# EAGLE design BusPirate-v2a (EAGLE 5.03)
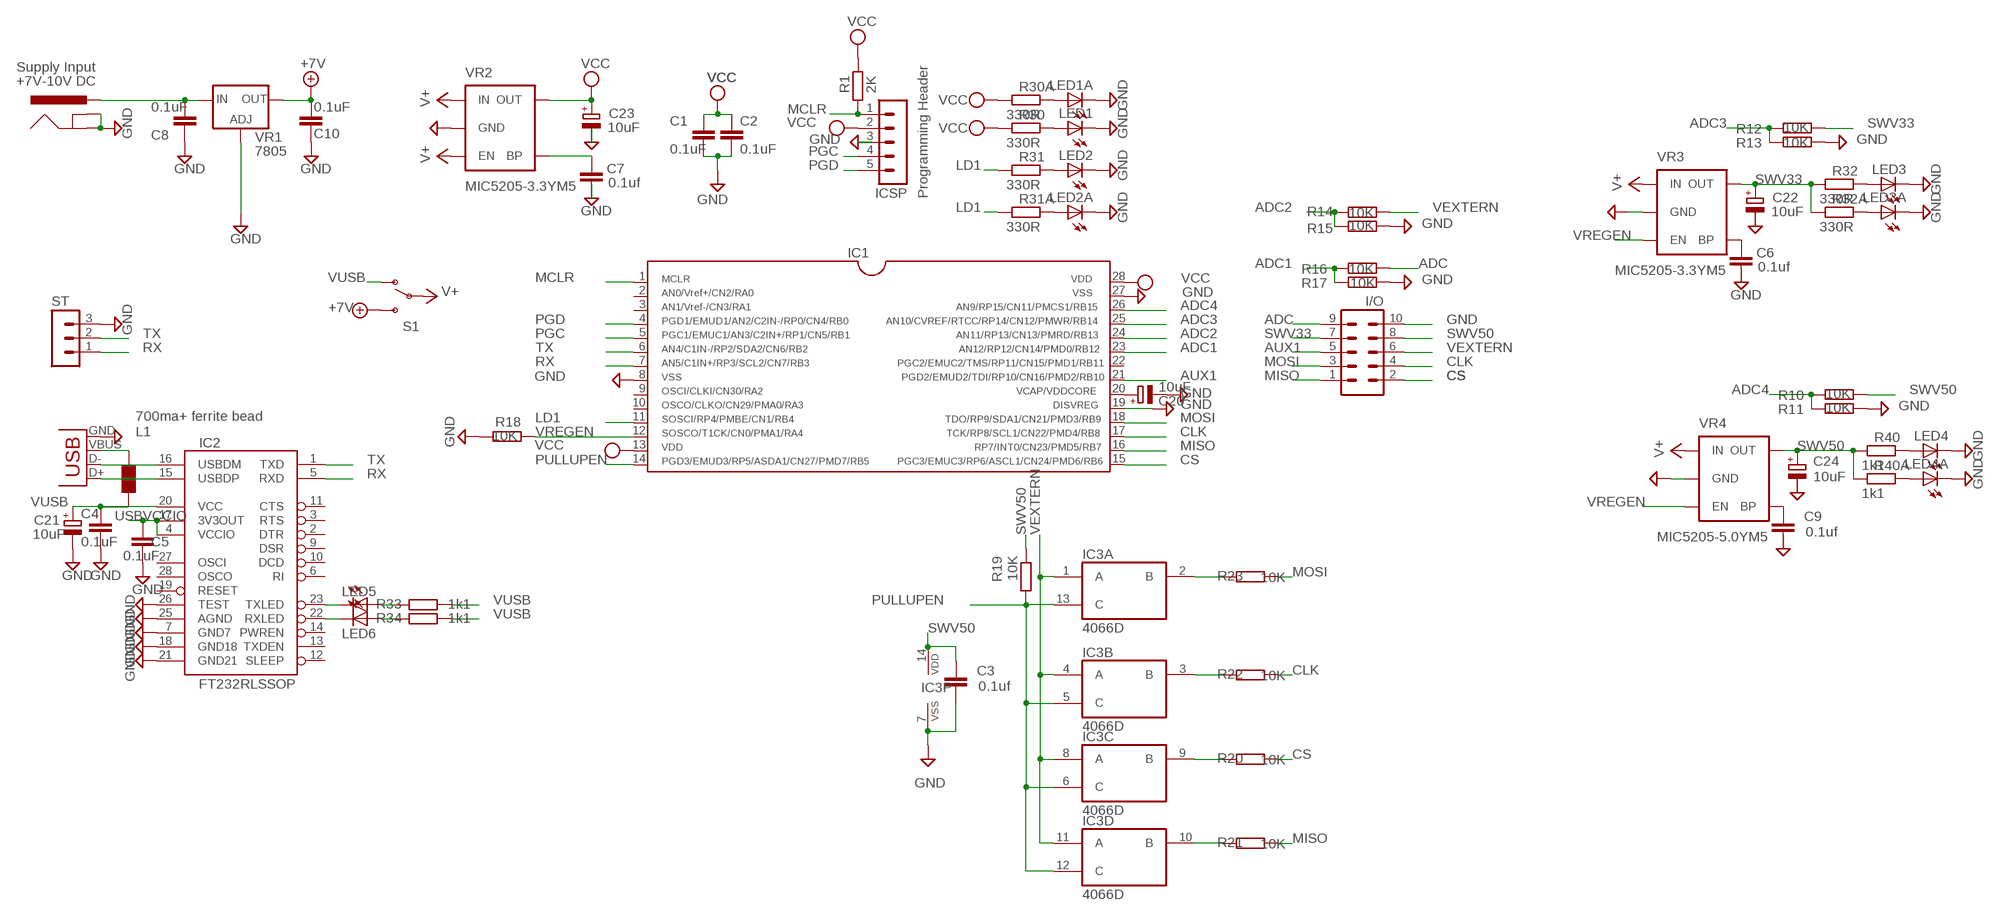
[diagram p0: schematic, sheet 1]

## Parts
C1  0.1uF  C-EUC0805  [C0805]
C2  0.1uF  C-EUC0805  [C0805]
C3  0.1uf  C-EUC0805  [C0805]
C4  0.1uF  C-EUC0805  [C0805]
C5  0.1uF  C-EUC0805  [C0805]
C6  0.1uf  C-EUC0805  [C0805]
C7  0.1uf  C-EUC0805  [C0805]
C8  0.1uF  C-EUC0805  [C0805]
C9  0.1uf  C-EUC0805  [C0805]
C10  0.1uF  C-EUC0805  [C0805]
C20  10uF  CPOL-EUSMCA  [SMC_A]
C21  10uF  CPOL-EUSMCA  [SMC_A]
C22  10uF  CPOL-EUSMCA  [SMC_A]
C23  10uF  CPOL-EUSMCA  [SMC_A]
C24  10uF  CPOL-EUSMCA  [SMC_A]
I/O  MA05-2  [MA05-2]
IC1  PIC24FJ64GA002  [SO28W]
IC2  FT232RLSSOP  [SSOP28DB]
IC3  4066D  [SO14]
ICSP  MA05-1  [MA05-1]
J1  POWER_JACKSMD  [POWER_JACK_SMD]
J2  USBSMD  [USB-MINIB]
L1  700ma+ ferrite bead  WE-KIL_0805  [WE-KI_0805_B]
LED1  LEDCHIP-LED0805  [CHIP-LED0805]
LED1A  LEDCHIP-LED0805  [CHIP-LED0805]
LED2  LEDCHIP-LED0805  [CHIP-LED0805]
LED2A  LEDCHIP-LED0805  [CHIP-LED0805]
LED3  LEDCHIP-LED0805  [CHIP-LED0805]
LED3A  LEDCHIP-LED0805  [CHIP-LED0805]
LED4  LEDCHIP-LED0805  [CHIP-LED0805]
LED4A  LEDCHIP-LED0805  [CHIP-LED0805]
LED5  LEDCHIP-LED0805  [CHIP-LED0805]
LED6  LEDCHIP-LED0805  [CHIP-LED0805]
R1  2K  R-EU_R0805  [R0805]
R10  10K  R-EU_M0805  [M0805]
R11  10K  R-EU_M0805  [M0805]
R12  10K  R-EU_M0805  [M0805]
R13  10K  R-EU_M0805  [M0805]
R14  10K  R-EU_M0805  [M0805]
R15  10K  R-EU_M0805  [M0805]
R16  10K  R-EU_M0805  [M0805]
R17  10K  R-EU_M0805  [M0805]
R18  10K  R-EU_M0805  [M0805]
R19  10K  R-EU_R0805  [R0805]
R20  10K  R-EU_R0805  [R0805]
R21  10K  R-EU_R0805  [R0805]
R22  10K  R-EU_R0805  [R0805]
R23  10K  R-EU_R0805  [R0805]
R30  330R  R-EU_M0805  [M0805]
R30A  330R  R-EU_M0805  [M0805]
R31  330R  R-EU_M0805  [M0805]
R31A  330R  R-EU_M0805  [M0805]
R32  330R  R-EU_M0805  [M0805]
R32A  330R  R-EU_M0805  [M0805]
R33  1k1  R-EU_M0805  [M0805]
R34  1k1  R-EU_M0805  [M0805]
R40  1k1  R-EU_M0805  [M0805]
R40A  1k1  R-EU_M0805  [M0805]
S1  SWITCH-SPSTPTH  [SWITCH-SPDT]
ST  MA03-1  [MA03-1]
VR1  7805  LD117AS50TR  [SOT223]
VR2  MIC5205-3.3YM5  V_REG_LDOSMD  [SOT23-5]
VR3  MIC5205-3.3YM5  V_REG_LDOSMD  [SOT23-5]
VR4  MIC5205-5.0YM5  V_REG_LDOSMD  [SOT23-5]

## Nets
$N26: J2.VBUS L1.2
+7V: C10.1 S1.3(S) VR1.4(OUT)
ADC: I/O.9 R16.1
ADC1: IC1.23 R16.2 R17.2
ADC2: IC1.24 R14.2 R15.2
ADC3: IC1.25 R12.2 R13.2
ADC4: IC1.26 R10.2 R11.2
AUX1: I/O.5 IC1.21
CLK: I/O.4 IC1.17 R22.1
CS: I/O.2 IC1.15 R20.1
GND: C1.2 C2.2 C3.2 C4.2 C5.2 C6.2 C7.2 C8.2 C9.2 C10.2 C20.- C21.- C22.- C23.- C24.- I/O.10 IC1.8 IC1.19 IC1.27 IC2.7(GND7) IC2.18(GND18) IC2.21(GND21) IC2.25(AGND) IC2.26(TEST) IC3.7(P:VSS) ICSP.3 J1.GND(GNDBREAK) J1.P$4(GND) J2.GND LED1.C LED1A.C LED2.C LED2A.C LED3.C LED3A.C LED4.C LED4A.C R11.1 R13.1 R15.1 R17.1 R18.2 ST.3 VR1.1(ADJ) VR2.2(GND) VR3.2(GND) VR4.2(GND)
LD1: IC1.11 R31.2 R31A.2
MCLR: IC1.1 ICSP.1 R1.1
MISO: I/O.1 IC1.16 R21.1
MOSI: I/O.3 IC1.18 R23.1
N$1: IC3.2(A:B) R23.2
N$2: IC3.3(B:B) R22.2
N$3: C20.+ IC1.20
N$4: IC3.10(D:B) R21.2
N$5: IC3.9(C:B) R20.2
N$6: LED2.A R31.1
N$7: LED1.A R30.1
N$8: C7.1 VR2.4(BP)
N$9: LED3A.A R32A.1
N$10: C9.1 VR4.4(BP)
N$11: LED4A.A R40A.1
N$12: C6.1 VR3.4(BP)
N$13: LED4.A R40.1
N$14: LED2A.A R31A.1
N$15: IC2.15(USBDP) J2.D+
N$16: IC2.16(USBDM) J2.D-
N$17: LED1A.A R30A.1
N$18: LED3.A R32.1
N$22: LED5.A R33.1
N$23: LED6.A R34.1
N$24: IC2.23(TXLED) LED5.C
N$25: IC2.22(RXLED) LED6.C
PGC: IC1.5 ICSP.4
PGD: IC1.4 ICSP.5
PULLUPEN: IC1.14 IC3.5(B:C) IC3.6(C:C) IC3.12(D:C) IC3.13(A:C) R19.2
RX: IC1.7 IC2.5(RXD) ST.1
SWV33: C22.+ I/O.7 R12.1 R32.2 R32A.2 VR3.5(OUT)
SWV50: C3.1 C24.+ I/O.8 IC3.14(P:VDD) R10.1 R19.1 R40.2 R40A.2 VR4.5(OUT)
TX: IC1.6 IC2.1(TXD) ST.2
USBVCCIO: C5.1 IC2.4(VCCIO) IC2.17(3V3OUT)
V+: S1.2(P) VR2.1(IN) VR2.3(EN) VR3.1(IN) VR4.1(IN)
VBAT: C8.1 J1.VIN0(PWR) VR1.3(IN)
VCC: C1.1 C2.1 C23.+ IC1.13 IC1.28 ICSP.2 R1.2 R30.2 R30A.2 VR2.5(OUT)
VEXTERN: I/O.6 IC3.1(A:A) IC3.4(B:A) IC3.8(C:A) IC3.11(D:A) R14.1
VREGEN: IC1.12 R18.1 VR3.3(EN) VR4.3(EN)
VUSB: C4.1 C21.+ IC2.20(VCC) L1.1 R33.2 R34.2 S1.1(O)
Unconnected: IC1.2 IC1.3 IC1.9 IC1.10 IC1.22 IC2.2(DTR) IC2.3(RTS) IC2.6(RI) IC2.9(DSR) IC2.10(DCD) IC2.11(CTS) IC2.12(SLEEP) IC2.13(TXDEN) IC2.14(PWREN) IC2.19(RESET) IC2.27(OSCI) IC2.28(OSCO)

## Notes on the sheet
- Supply Input
- +7V-10V DC
- Programming Header

## Library data of the parts
C1-C10 = rcl:C-EU: CAPACITOR, European symbol
C20-C24 = rcl:CPOL-EU: POLARIZED CAPACITOR, European symbol
I/O = con-lstb:MA05-2: PIN HEADER
IC1 = microchip-pic24:PIC24FJ64GA002
IC2 = SparkFun:FT232RL: USB UART FT232RL 4th Generation USB UART (USB <-> Serial) Controller. Spark Fun Electronics SKU : COM-00650
IC3 = 40xx:4066: Quad bilateral ANALOG SWITCH
ICSP = con-lstb:MA05-1: PIN HEADER
J1 = SparkFun:POWER_JACK: Power Jack This is the standard 5.5mm barrel jack for power. The PTH is the most common, proven, reliable, footprint. All others are experimental. The Slot footprint only works if the mill layer is transmitted to the PCB fab house so be warned. Spark Fun Electronics SKU : PRT-00119. Mating wall wart : TOL-00298 (and others)
J2 = SparkFun:USB: USB Connectors USB-B-PTH is fully proven SKU : PRT-00139 USB-miniB is fully proven SKU : PRT-00587 USB-A-PCB is untested. USB-A-H is throughly reviewed, but untested. Spark Fun Electronics SKU : PRT-00437 USB-B-SMT is throughly reviewed, but untested. Needs silkscreen touching up. USB-A-S has not been used/tested USB-MB-H has not been used/tested
L1 = wuerth-elektronik:WE-KIL: SMD Wire Wound Ceramic Inductor WE-KIL - Low profile - High Q values -- Bluetooth -- Wireless LAN -- RF oscillation circuit -- IF impedance matching
LED1 LED1A LED2 LED2A LED3 LED3A LED4 LED4A LED5 LED6 = led:LED: LED OSRAM: - CHIPLED LG R971, LG N971, LY N971, LG Q971, LY Q971, LO R971, LY R971 LH N974, LH R974 LS Q976, LO Q976, LY Q976 LO Q996 - Hyper CHIPLED LW Q18S LB Q993, LB Q99A, LB R99A - SideLED LS A670, LO A670, LY A670, LG A670, LP A670 LB A673, LV A673, LT A673, LW A673 LH A674 LY A675 LS A676, LA A676, LO A676, LY A676, LW A676 LS A679, LY A679, LG A679 - Hyper Micro SIDELED® LS Y876, LA Y876, LO Y876, LY Y876 LT Y87S - SmartLED LW L88C, LW L88S LB L89C, LB L89S, LG L890 LS L89K, LO L89K, LY L89K LS L896, LA L896, LO L896, LY L896 - TOPLED LS T670, LO T670, LY T670, LG T670, LP T670 LSG T670, LSP T670, LSY T670, LOP T670, LYG T670 LG T671, LOG T671, LSG T671 LB T673, LV T673, LT T673, LW T673 LH T674 LS T676, LA T676, LO T676, LY T676, LB T676, LH T676, LSB T676, LW T676 LB T67C, LV T67C, LT T67C, LS T67K, LO T67K, LY T67K, LW E67C LS E67B, LA E67B, LO E67B, LY E67B, LB E67C, LV E67C, LT E67C LW T67C LS T679, LY T679, LG T679 LS T770, LO T770, LY T770, LG T770, LP T770 LB T773, LV T773, LT T773, LW T773 LH T774 LS E675, LA E675, LY E675, LS T675 LS T776, LA T776, LO T776, LY T776, LB T776 LHGB T686 LT T68C, LB T68C - Hyper Mini TOPLED® LB M676 - Mini TOPLED Santana® LG M470 LS M47K, LO M47K, LY M47K Source: http://www.osram.convergy.de LUXEON: - LUMILED® LXK2-PW12-R00, LXK2-PW12-S00, LXK2-PW14-U00, LXK2-PW14-V00 LXK2-PM12-R00, LXK2-PM12-S00, LXK2-PM14-U00 LXK2-PE12-Q00, LXK2-PE12-R00, LXK2-PE12-S00, LXK2-PE14-T00, LXK2-PE14-U00 LXK2-PB12-K00, LXK2-PB12-L00, LXK2-PB12-M00, LXK2-PB14-N00, LXK2-PB14-P00, LXK2-PB14-Q00 LXK2-PR12-L00, LXK2-PR12-M00, LXK2-PR14-Q00, LXK2-PR14-R00 LXK2-PD12-Q00, LXK2-PD12-R00, LXK2-PD12-S00 LXK2-PH12-R00, LXK2-PH12-S00 LXK2-PL12-P00, LXK2-PL12-Q00, LXK2-PL12-R00 Source: www.luxeon.com KINGBRIGHT: KA-3528ASYC Source: www.kingbright.com
R1 R19-R23 R30 R30A R31 R31A R32 R32A R33 R34 R40 R40A = rcl:R-EU_: RESISTOR, European symbol
R10-R18 = resistor:R-EU_: RESISTOR, European symbol
S1 = SparkFun:SWITCH-SPST: SPST Switch Simple slide switch. Spark Fun Electronics SKU : COM-00102
ST = con-lstb:MA03-1: PIN HEADER
VR1 = v-reg:LD117A?*: Low drop fixed and adjustable positive voltage regulators 1 A Source: http://www.st.com/stonline/products/literature/ds/7194/ld1117axx.pdf
VR2-VR4 = SparkFun:V_REG_LDO: Voltage Regulator LDO Standard 150mA LDO voltage regulator in SOT-23 layout. Micrel part MIC5205. BP (by-pass) pin is used to lower output noise with 470pF cap.

## Board
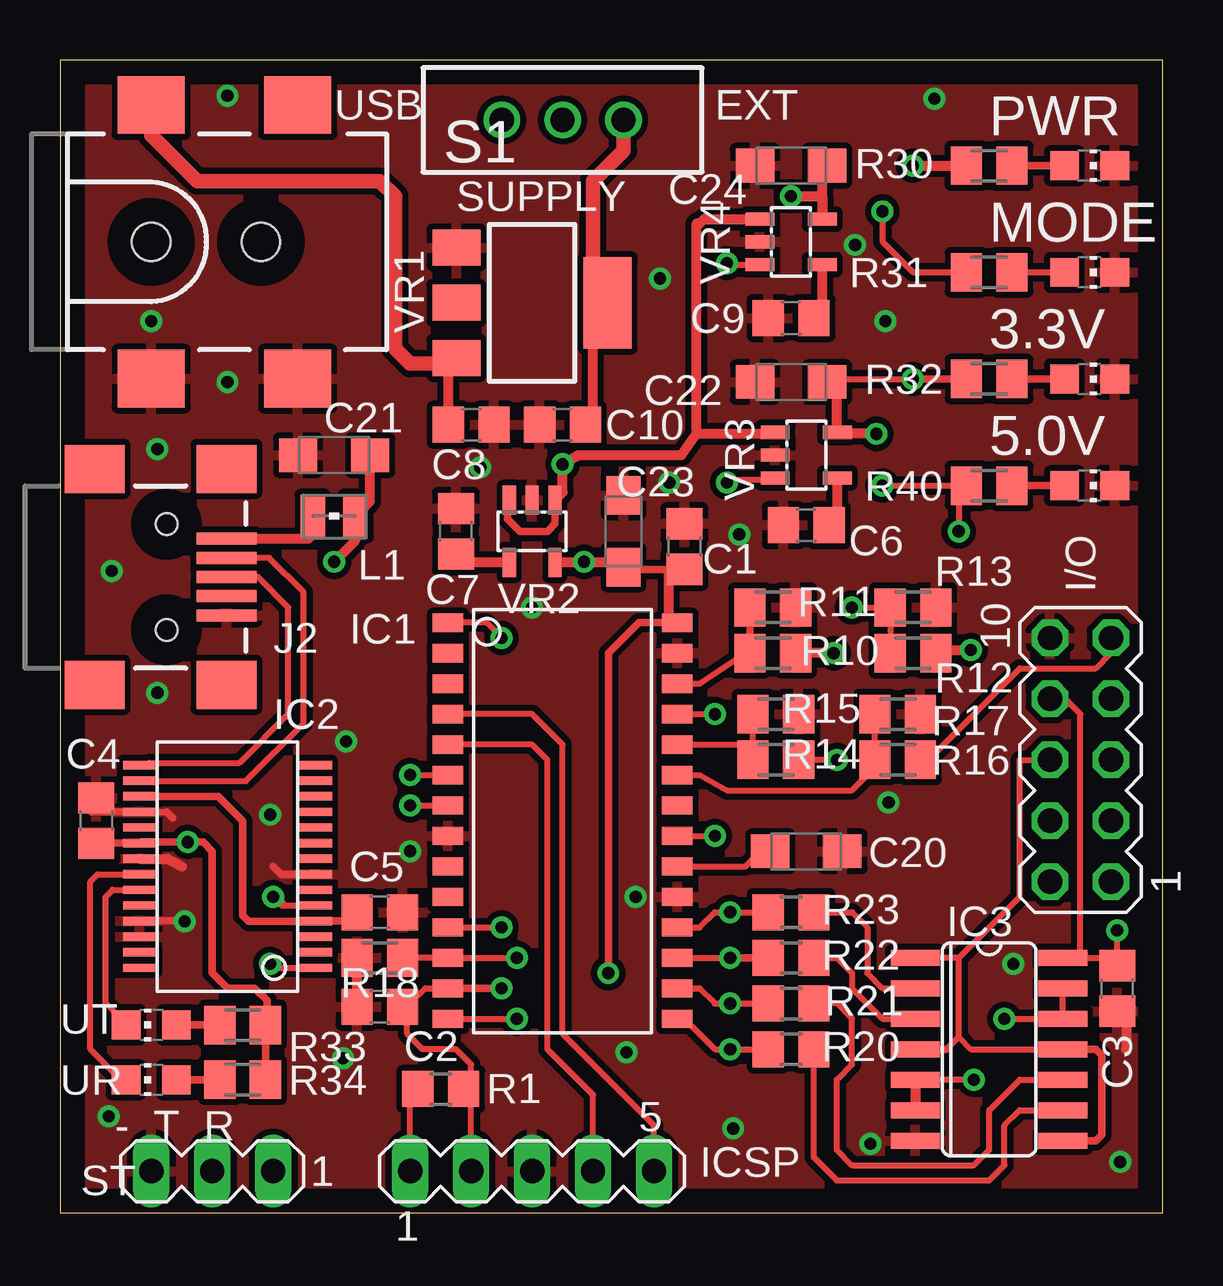
[diagram p1: board, top side]
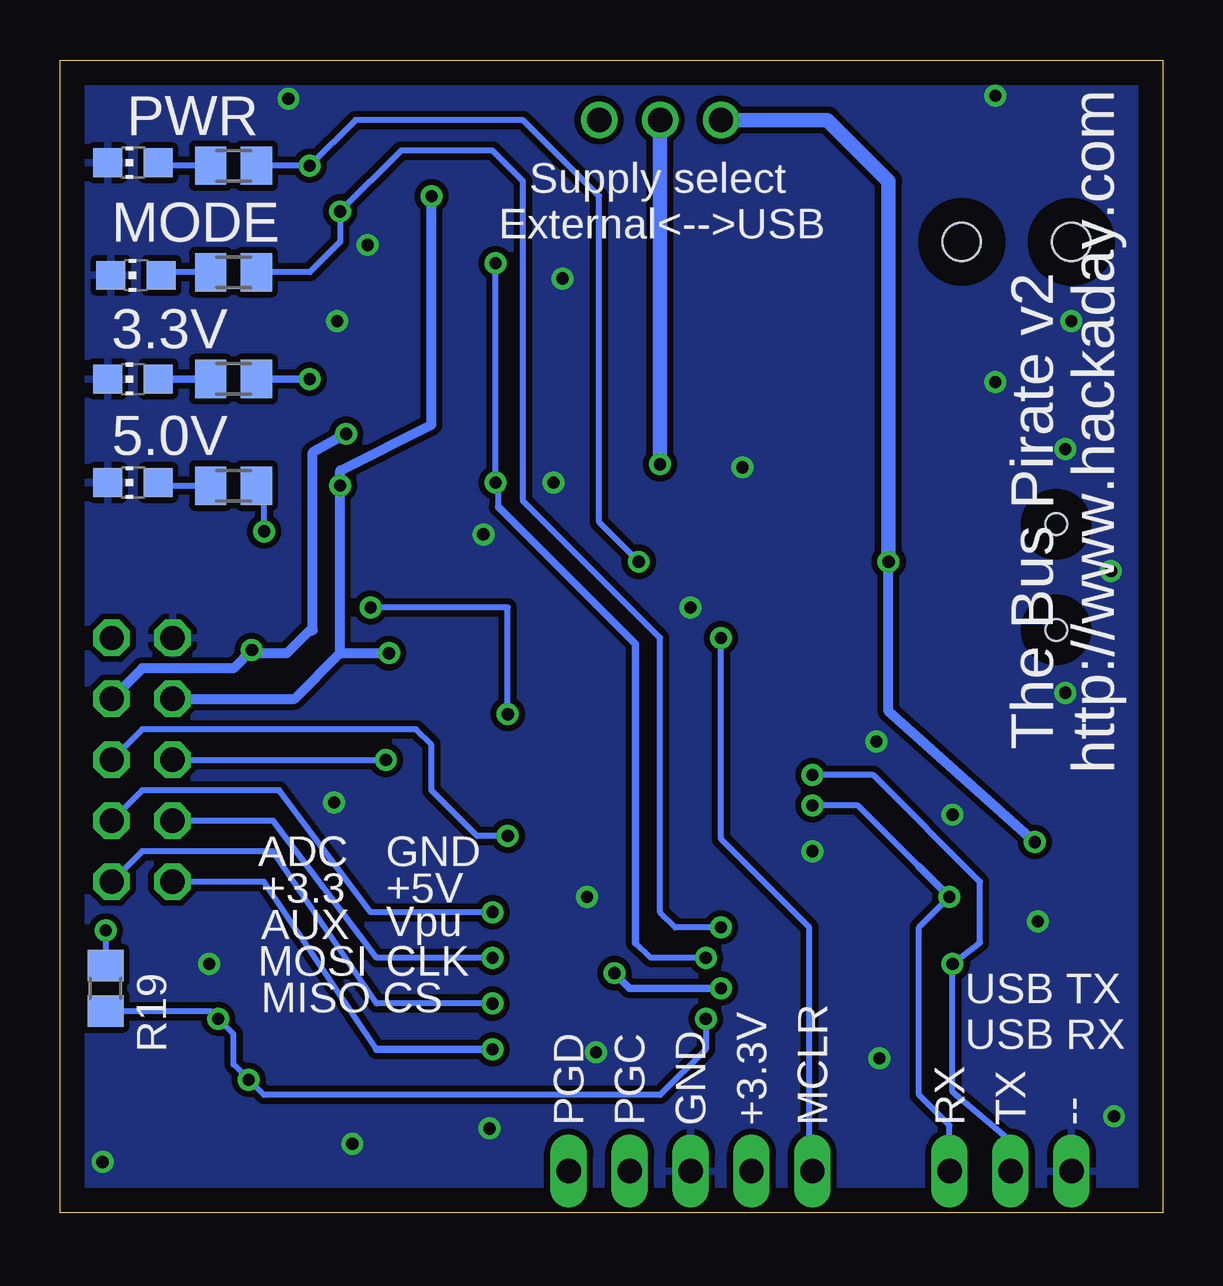
[diagram p2: board, bottom side, seen from below]

Size 45.96 x 48.06 mm. Coordinates in mm from the lower left corner, seen from the top.
Outline: 45.96,0 45.96,48.06 0,48.06 0,0 45.96,0
Copper layers (1*16): Top 0.035mm / dielectric 1.5mm / Bottom 0.035mm
Design rules "8mils": minimum track width 10mil, minimum drill 24mil, track to track 8mil, track to pad 8mil, pad to pad 8mil, via to via 8mil, smd to smd 8mil, copper to edge 40mil, drill to drill 10mil, minimum pad ring 10mil, minimum via ring 8mil, stop-mask expansion 0mil, vias tented up to drill 0mil, thermal gap 10mil

### Footprints (pad centres in the part's own frame; a part is rotated, then mirrored left to right if it is on the bottom)
C0805 = smd 1.3 x 1.5: 1 -0.95,0; 2 0.95,0
SMC_A = smd 1.6 x 1.4: + -1.5,0; - 1.5,0
MA05-2 = drill 1.016 octagon: 1 -5.08,-1.27; 2 -5.08,1.27; 3 -2.54,-1.27; 4 -2.54,1.27; 5 0,-1.27; 6 0,1.27; 7 2.54,-1.27; 8 2.54,1.27; 9 5.08,-1.27; 10 5.08,1.27
SO28W = smd 0.762 x 1.27: 1 -8.89,-4.78; 2 -7.62,-4.78; 3 -6.35,-4.78; 4 -5.08,-4.78; 5 -3.81,-4.78; 6 -2.54,-4.78; 7 -1.27,-4.78; 8 0,-4.78; 9 1.27,-4.78; 10 2.54,-4.78; 11 3.81,-4.78; 12 5.08,-4.78; 13 6.35,-4.78; 14 7.62,-4.78; 15 7.62,4.78; 16 6.35,4.78; 17 5.08,4.78; 18 3.81,4.78; 19 2.54,4.78; 20 1.27,4.78; 21 0,4.78; 22 -1.27,4.78; 23 -2.54,4.78; 24 -3.81,4.78; 25 -5.08,4.78; 26 -6.35,4.78; 27 -7.62,4.78; 28 -8.89,4.78
SSOP28DB = smd 0.348 x 1.397: 1 -4.225,-3.656; 2 -3.575,-3.656; 3 -2.925,-3.656; 4 -2.275,-3.656; 5 -1.625,-3.656; 6 -0.975,-3.656; 7 -0.325,-3.656; 8 0.325,-3.656; 9 0.975,-3.656; 10 1.625,-3.656; 11 2.275,-3.656; 12 2.925,-3.656; 13 3.575,-3.656; 14 4.225,-3.656; 15 4.225,3.656; 16 3.575,3.656; 17 2.925,3.656; 18 2.275,3.656; 19 1.625,3.656; 20 0.975,3.656; 21 0.325,3.656; 22 -0.325,3.656; 23 -0.975,3.656; 24 -1.625,3.656; 25 -2.275,3.656; 26 -2.925,3.656; 27 -3.575,3.656; 28 -4.225,3.656
SO14 = smd 0.66 x 2.032: 1 -3.81,-3.073; 2 -2.54,-3.073; 3 -1.27,-3.073; 4 0,-3.073; 5 1.27,-3.073; 6 2.54,-3.073; 7 3.81,-3.073; 8 3.81,3.073; 9 2.54,3.073; 10 1.27,3.073; 11 0,3.073; 12 -1.27,3.073; 13 -2.54,3.073; 14 -3.81,3.073
MA05-1 = drill 1.016 long: 1 -5.08,0; 2 -2.54,0; 3 0,0; 4 2.54,0; 5 5.08,0
POWER_JACK_SMD = smd 2.8 x 2.4: GND 0,-5.7; P$4 6.1,-5.7; VIN0 0,5.7; VIN1 6.1,5.7 | hole 1.6: 0,0; 4.572,0
USB-MINIB = smd 2.5 x 0.5: D+ 2.5,0; D- 2.5,0.8; GND 2.5,-1.6; ID 2.5,-0.8; VBUS 2.5,1.6 | smd 2.5 x 2: GND@1 -3,-4.5; GND@2 -3,4.5; GND@3 2.5,4.5; GND@4 2.5,-4.5 | hole 0.9: 0,2.2; 0,-2.2
WE-KI_0805_B = smd 1.02 x 1.78: 1 -0.89,0; 2 0.89,0
CHIP-LED0805 = smd 1.2 x 1.2: A 0,-1.05; C 0,1.05
R0805 = smd 1.3 x 1.5: 1 -0.95,0; 2 0.95,0
M0805 = smd 1.3 x 1.6: 1 -0.95,0; 2 0.95,0
SWITCH-SPDT = drill 1.016 round: 1 0,2.54; 2 0,0; 3 0,-2.54
MA03-1 = drill 1.016 long: 1 -2.54,0; 2 0,0; 3 2.54,0
SOT223 = smd 1.5 x 2: 1 -2.3,-3.15; 2 0,-3.15; 3 2.3,-3.15 | smd 3.8 x 2: 4 0,3.15
SOT23-5 = smd 0.55 x 1.2: 1 -0.95,-1.3; 2 0,-1.3; 3 0.95,-1.3; 4 0.95,1.3; 5 -0.95,1.3

### Placement (x,y rotation side)
C1  26.03,27.77 90 top
C2  13.33,8.6 180 top
C3  44.06,9.36 270 top
C4  1.52,16.34 90 top
C5  13.33,12.54 0 top
C6  31.11,28.66 180 top
C7  16.5,28.41 90 top
C8  17.14,32.86 0 top
C9  30.47,37.3 180 top
C10  20.95,32.86 180 top
C20  31.11,15.07 0 top
C21  11.43,31.59 180 top
C22  30.47,34.63 180 top
C23  23.49,28.41 90 top
C24  30.47,43.65 180 top
I/O  42.54,18.88 90 top
IC1  20.95,15.71 270 top
IC2  6.98,14.44 90 top
IC3  38.73,6.82 270 top
ICSP  19.68,1.74 0 top
J1  3.8,40.48 0 top
J2  4.44,26.51 0 top
L1  11.43,29.05 180 top
LED1  42.92,43.65 270 top
LED1A  42.92,43.78 90 bottom
LED2  42.92,39.2 270 top
LED2A  42.79,39.08 90 bottom
LED3  42.92,34.76 270 top
LED3A  42.92,34.76 90 bottom
LED4  42.92,30.31 270 top
LED4A  42.92,30.44 90 bottom
LED5  3.8,7.84 90 top
LED6  3.8,5.55 90 top
R1  15.87,5.17 0 top
R10  29.71,23.33 180 top
R11  29.71,25.23 180 top
R12  35.55,23.33 180 top
R13  35.55,25.23 180 top
R14  29.84,18.88 180 top
R15  29.84,20.79 180 top
R16  34.92,18.88 180 top
R17  34.92,20.79 180 top
R18  13.33,10.63 180 top
R19  44.06,9.36 270 bottom
R20  30.47,6.82 0 top
R21  30.47,8.73 0 top
R22  30.47,10.63 0 top
R23  30.47,12.54 0 top
R30  38.73,43.65 180 top
R30A  38.73,43.65 0 bottom
R31  38.73,39.2 180 top
R31A  38.73,39.2 0 bottom
R32  38.73,34.76 180 top
R32A  38.73,34.76 0 bottom
R33  7.62,7.84 0 top
R34  7.62,5.55 0 top
R40  38.73,30.31 180 top
R40A  38.73,30.31 0 bottom
S1  20.95,45.55 90 top
ST  6.34,1.74 180 top
VR1  19.68,37.94 270 top
VR2  19.68,28.41 180 top
VR3  31.11,31.59 270 top
VR4  30.47,40.48 270 top

### Tracks (layer width: path | path; a pad name or v marks a point on that pad's centre or on a via)
$N26
  Top 0.406: J2.VBUS 10.36,28.11 10.54,28.28 L1.2
+7V
  Top 0.254: 22.86,37.94 VR1.4 22.22,37.94
  Top 0.406: C10.1 22.22,32.86 22.22,37.94
  Top 0.61: 22.22,37.94 22.22,43.02 23.49,44.29 S1.3
ADC
  Top 0.254: I/O.9 43.81,23.33 43.17,22.7 40,22.7 36.19,18.88
  Top 0.305: R16.1 36.19,18.88
ADC1
  Top 0.254: IC1.23 26.67,18.25 27.81,17.62 33.02,17.62 33.65,18.25 | R16.2 R17.2
  Top 0.305: 33.65,18.25 33.65,19.2 R16.2
ADC2
  Top 0.254: 28.89,19.52 R14.2 | 28.89,19.52 R15.2 | IC1.24 28.89,19.52
  Top 0.305: R14.2 29.02,19.45
ADC3  (via drill 0.51)
  Top 0.254: v33.02,25.23 34.28,25.23 | IC1.25 v27.3,20.79 | 34.61,24.91 R12.2
  Top 0.305: R13.2 34.61,24.91 34.28,25.23
  Bottom 0.254: v33.02,25.23 27.3,25.23 v27.3,20.79
ADC4
  Top 0.254: IC1.26 26.67,22.06 28.57,23.33
  Top 0.305: R10.2 R11.2
  Top 0.406: 28.57,23.33 R10.2
AUX1  (via drill 0.51)
  Top 0.254: IC1.21 v27.3,15.71
  Bottom 0.254: v27.3,15.71 28.57,15.71 30.47,17.62 30.47,19.52 31.11,20.16 42.54,20.16 I/O.5
CLK  (via drill 0.51)
  Top 0.254: IC1.17 v27.93,10.63
  Top 0.305: v27.93,10.63 R22.1
  Bottom 0.254: I/O.4 37.08,16.34 32.76,10.63 v27.93,10.63
CS  (via drill 0.51)
  Top 0.254: 26.03,8.09 27.3,6.82 v27.93,6.82 R20.1
  Top 0.305: IC1.15 26.03,8.09
  Bottom 0.254: I/O.2 37.46,13.8 32.76,6.82
  Bottom 0.305: v27.93,6.82 32.76,6.82
GND  (via drill 0.51)
  Top 0.254: IC2.18 4.45,16.72
  Top 0.305: IC2.18 1.32,16.72 C4.2 | IC2.7 9.21,14.12 8.88,14.44 | 4.45,16.72 4.69,16.47 | IC2.25 5.2,12.16 v5.2,12.15
  Top 0.406: IC2.21 4.5,14.77 5.07,14.44 | C2.2 R18.2 | C3.2 44.44,8.41 44.44,6.82
  other vias: 6.98,46.57 36.44,46.44 14.6,15.07 25.39,30.44 17.52,31.08 4.06,21.68 2.15,26.76 4.06,31.84 6.98,34.63 24,13.17 33.78,2.88 11.93,19.65 19.68,25.23 11.81,6.44 2.03,4.03 33.14,40.35 25.01,38.95 28.32,28.28 8.76,16.6 28.06,3.52 23.62,6.69 3.8,37.17 44.19,2.12 34.41,37.17 39.75,10.38 34.54,17.11
  pour Top (isolate 0.254): -0.01,48.1 46.35,48.1 46.35,0.47 -0.01,0.47
  pour Bottom (isolate 0.254): -0.01,48.1 46.35,48.1 46.35,0.47 -0.01,0.47
LD1  (via drill 0.51)
  Top 0.254: IC1.11 v18.41,11.9 | v34.28,41.74 34.28,40.48 35.55,39.2 R31A.2
  Bottom 0.254: v18.41,11.9 20.32,11.9 20.95,12.54 20.95,23.97 26.67,29.68 26.67,43.02 27.93,44.29 31.75,44.29 v34.28,41.74 34.28,40.48 35.55,39.2 R31A.2
MCLR  (via drill 0.51)
  Top 0.254: ICSP.1 14.6,4.6 | IC1.1 17.77,24.6 v18.41,23.97
  Top 0.305: 14.6,4.6 R1.1
  Bottom 0.254: v18.41,23.97 18.41,15.58 14.73,11.9 14.73,1.87 ICSP.1
MISO  (via drill 0.51)
  Top 0.254: IC1.16 26.67,9.36 27.3,8.73 v27.93,8.73 R21.1
  Bottom 0.254: I/O.1 42.54,15.07 37.08,15.07 32.76,8.73 v27.93,8.73
MOSI  (via drill 0.51)
  Top 0.254: IC1.18 26.67,11.9 27.3,12.54 v27.93,12.54 R23.1
  Bottom 0.254: I/O.3 42.54,17.62 36.83,17.62 33.02,12.54 v27.93,12.54
N$1
  Top 0.254: IC3.2 34.28,9.36 33.65,10 33.65,11.9 33.02,12.54 R23.2
N$2
  Top 0.254: IC3.3 34.28,8.09 33.02,9.36 33.02,10 32.38,10.63 R22.2
N$3
  Top 0.254: IC1.20 28.57,14.44 29.21,15.07 C20.+
N$4
  Top 0.254: IC3.10 40,5.55 38.73,4.28 38.73,2.63 38.09,1.99 33.02,1.99 32.38,2.63 32.38,5.55 33.02,6.19 33.02,8.09 32.38,8.73 R21.2
N$5
  Top 0.254: R20.2 31.43,2.31 32.38,1.36 38.73,1.36 39.36,1.99 39.36,3.64 40,4.28 IC3.9
N$6
  Top 0.254: R31.1 LED2.A
N$7
  Top 0.305: R30.1 LED1.A
N$8
  Top 0.406: VR2.4 16.5,27.11 C7.1
N$9
  Bottom 0.305: LED3A.A R32A.1
N$10
  Top 0.305: C9.1 31.78,37.65
  Top 0.406: 31.78,37.65 VR4.4
N$11
  Bottom 0.254: R40A.1 41.74,30.31 LED4A.A
N$12
  Top 0.406: VR3.4 32.41,28.76 C6.1
N$13
  Top 0.305: R40.1 LED4.A
N$14
  Bottom 0.254: R31A.1 41.62,39.2 LED2A.A
N$15
  Top 0.254: J2.D+ 8.25,26.51 9.52,25.23 9.52,20.79 7.49,18.76 3.74,18.76 IC2.15
N$16
  Top 0.254: J2.D- 8.72,27.3 10.16,25.87 10.16,20.41 7.74,18 3.34,18 IC2.16
N$17
  Bottom 0.254: R30A.1 41.87,43.65 LED1A.A
N$18
  Top 0.305: R32.1 LED3.A
N$22
  Top 0.305: LED5.A R33.1
N$23
  Top 0.305: LED6.A R34.1
N$24
  Top 0.254: LED5.C 2.54,8.09 1.9,8.73 1.9,13.17 2.2,13.46 IC2.23
N$25
  Top 0.254: IC2.22 1.57,14.12 1.26,13.8 1.26,6.82 2.54,5.55 LED6.C
PGC
  Top 0.254: IC1.5 19.68,19.52 20.32,18.88 20.32,6.82 22.22,4.91 ICSP.4
PGD
  Top 0.254: IC1.4 19.68,20.79 20.95,19.52 20.95,7.46 24.76,3.64 ICSP.5
PULLUPEN  (via drill 0.51)
  Top 0.254: v39.36,8.09 IC3.12 IC3.13 | v38.09,5.55 IC3.5 | IC1.14 v19.04,8.09
  Top 0.406: IC3.5 IC3.6
  Bottom 0.254: v19.04,8.09 19.04,6.82 20.95,4.91 37.46,4.91 v38.09,5.55 38.73,6.19 38.73,7.46 v39.36,8.09 39.69,8.41 R19.2
RX  (via drill 0.51)
  Top 0.254: v14.6,16.98 IC1.7 | IC2.5 9.24,12.82 v8.88,13.17
  Top 0.305: v8.88,13.17 9.01,13.17 9.27,12.92
  Bottom 0.254: v14.6,16.98 12.7,16.98 10.16,14.44 | ST.1 8.88,3.64 10.16,4.91 10.16,11.9 v8.88,13.17
  Bottom 0.305: v8.88,13.17 10.16,14.44
SWV33  (via drill 0.51)
  Top 0.254: 32.38,34.76 v35.55,34.76 R32A.2
  Top 0.305: v35.55,34.76 R32A.2
  Top 0.406: C22.+ 31.97,34.15 | R12.1 36.7,23.33 36.83,23.46 v37.97,23.46 | C22.+ 31.97,34.76 32.38,34.76 32.38,32.56 VR3.5 32.47,32.47 v34.03,32.47 | C22.+ 32.1,34.76
  Bottom 0.305: v35.55,34.76 R32A.2
  Bottom 0.406: I/O.7 42.54,22.7 38.73,22.7 v37.97,23.46 37.84,23.33 R12.1 35.55,24.28 35.43,24.28 35.43,31.71 v34.03,32.47
SWV50  (via drill 0.51)
  Top 0.254: 42.54,10.63 42.54,20.79 41.91,21.43 I/O.8 | v34.28,30.31 R40A.2 37.46,30.63 v37.46,28.41 | IC3.14 42.54,10.63 | 42.54,10.63 43.49,10.63 C3.1 | 42.54,10.63 44.13,10.63 C3.1 | C3.1 v44.06,11.77
  Top 0.305: 31.78,43.45 C24.+ 32.29,43.97
  Top 0.406: 31.78,43.45 VR4.5 31.78,42.35 31.75,42.38 v30.47,42.38 | v32.25,23.33 R10.1
  Bottom 0.254: v44.06,11.77 C3.1 | v37.46,28.41 37.46,29.99 R40A.2
  Bottom 0.406: v30.47,42.38 30.47,32.86 34.28,30.95 v34.28,30.31 34.28,23.33 | 34.28,23.33 36.19,21.43 I/O.8 | 34.28,23.33 v32.25,23.33
TX  (via drill 0.51)
  Top 0.254: 8.66,10.21 IC2.1 | v14.6,18.25 IC1.6
  Top 0.305: v8.76,10.38 8.66,10.21
  Bottom 0.254: v14.6,18.25 12.06,18.25 7.62,13.8 7.62,11.27 v8.76,10.38 8.76,5.04 6.34,3.01
  Bottom 0.305: ST.2 6.34,3.01
USBVCCIO
  Top 0.305: C5.1 12.01,12.16 IC2.4 10.62,12.15 7.87,12.15 7.62,12.41 7.62,12.54 7.62,16.34 6.59,17.37 IC2.17
V+  (via drill 0.51)
  Top 0.305: VR2.1 20.63,28.73 20.32,28.41 19.17,28.41 18.66,28.92 18.66,29.64 VR2.3
  Top 0.406: VR2.1 20.95,30.03 v20.95,31.2 21.59,31.59 25.9,31.59 26.54,32.47 26.67,32.47 | 26.54,41.11 26.54,41.24 | 26.67,32.47 29.75,32.47 VR3.1 | VR4.1 26.85,41.43 26.54,41.11 | 26.54,41.11 26.54,32.6 26.67,32.47
  Bottom 0.61: v20.95,31.2 S1.2
VBAT
  Top 0.254: 16.19,35.3 16.29,35.4 VR1.3
  Top 0.406: C8.1 16.19,35.3
  Top 0.61: J1.VIN0 3.8,44.92 5.71,43.02 13.33,43.02 13.96,42.38 13.96,36.03 14.6,35.4 16.29,35.4
VCC  (via drill 0.51)
  Top 0.254: 21.59,27.11 v21.84,27.14 | 14.47,8.54 14.47,7.46 15.11,6.82 16.5,6.82 17.14,6.19 17.14,5.49 R1.2 | IC1.13 15.23,9.36 14.6,8.73 14.41,8.73 C2.1 | ICSP.2 17.14,4.6
  Top 0.305: C1.1 25.39,26.83 22.94,26.83 C23.+ | IC1.28 24.12,24.6 22.86,23.33 v22.86,10 | 17.14,4.6 R1.2 | 14.47,8.54 C2.1 | IC1.13 v18.41,9.36
  Top 0.406: VR2.5 21.59,27.11 22.86,27.11 C23.+ | 25.39,26.83 25.39,24.94 IC1.28 | v35.55,43.65 R30A.2
  Bottom 0.254: v21.84,27.14 23.49,28.79 23.49,42.38 26.67,45.55 33.65,45.55 v35.55,43.65 R30A.2
  Bottom 0.305: v18.41,9.36 22.22,9.36 v22.86,10
VEXTERN  (via drill 0.51)
  Top 0.254: I/O.6 40,18.88 40,13.17 37.46,10.63 | v32.38,18.88 R14.1 | 37.46,7.33 37.46,10.63 | 37.46,10.63 IC3.1 | IC3.11 37.97,6.82 37.46,7.33 | 36.95,6.82 37.46,7.33
  Top 0.305: IC3.11 43.17,6.82 43.43,6.57 43.43,3.26 43.17,3.01 IC3.8 | IC3.4 36.95,6.82
  Bottom 0.254: I/O.6 v32.38,18.88
VREGEN  (via drill 0.51)
  Top 0.254: R18.1 IC1.12 v19.04,10.63 | 29.74,30.57 27.93,30.57 v27.81,30.44 | 28.89,39.52 27.87,39.52 v27.81,39.59
  Top 0.305: 28.89,39.52 VR4.3 | 29.74,30.57 VR3.3
  Bottom 0.254: v27.81,39.59 v27.81,30.44 27.68,30.31 27.68,29.43 | v19.04,10.63 21.33,10.63 21.97,11.27
  Bottom 0.305: 21.97,11.27 21.97,23.71 27.68,29.43
VUSB  (via drill 0.51)
  Top 0.305: C4.1 1.92,15.41 IC2.20 3.37,15.46 v5.33,15.46 5.96,15.46 6.34,15.07 6.34,10 6.98,9.36 8.12,9.36 8.63,8.85 8.63,7.9 R33.2 R34.2
  Top 0.406: C21.+ 12.93,29.66 L1.1 12.32,28.03 v11.43,27.14
  Bottom 0.406: v11.43,27.14 11.43,20.92 v5.33,15.46
  Bottom 0.61: S1.1 13.96,45.55 11.43,43.02 v11.43,27.14

### Text on the board
tNames: USB | EXT | PWR | SUPPLY | MODE | 3.3V | 5.0V | UT | UR | - T R
bNames: http://www.hackaday.com | PWR | Supply select | External<-->USB | MODE | The Bus Pirate v2 | 3.3V | 5.0V | GND | ADC | +5V | +3.3 | Vpu | AUX | CLK | MOSI | USB TX | CS | MISO | USB RX | -- | TX | RX | MCLR | +3.3V | GND | PGC | PGD
Document: Supply selector | USB<-->External | Power jack | 8-12volts DC | USB | GND | ADC | +5v | +3v | Vpu | AUX1 | CLK | MOSI | CS | MISO | I/O header | MCLR | +3.3V | GND | CLOCK | DATA | TX | RX | GND | Serial port | Programming Header